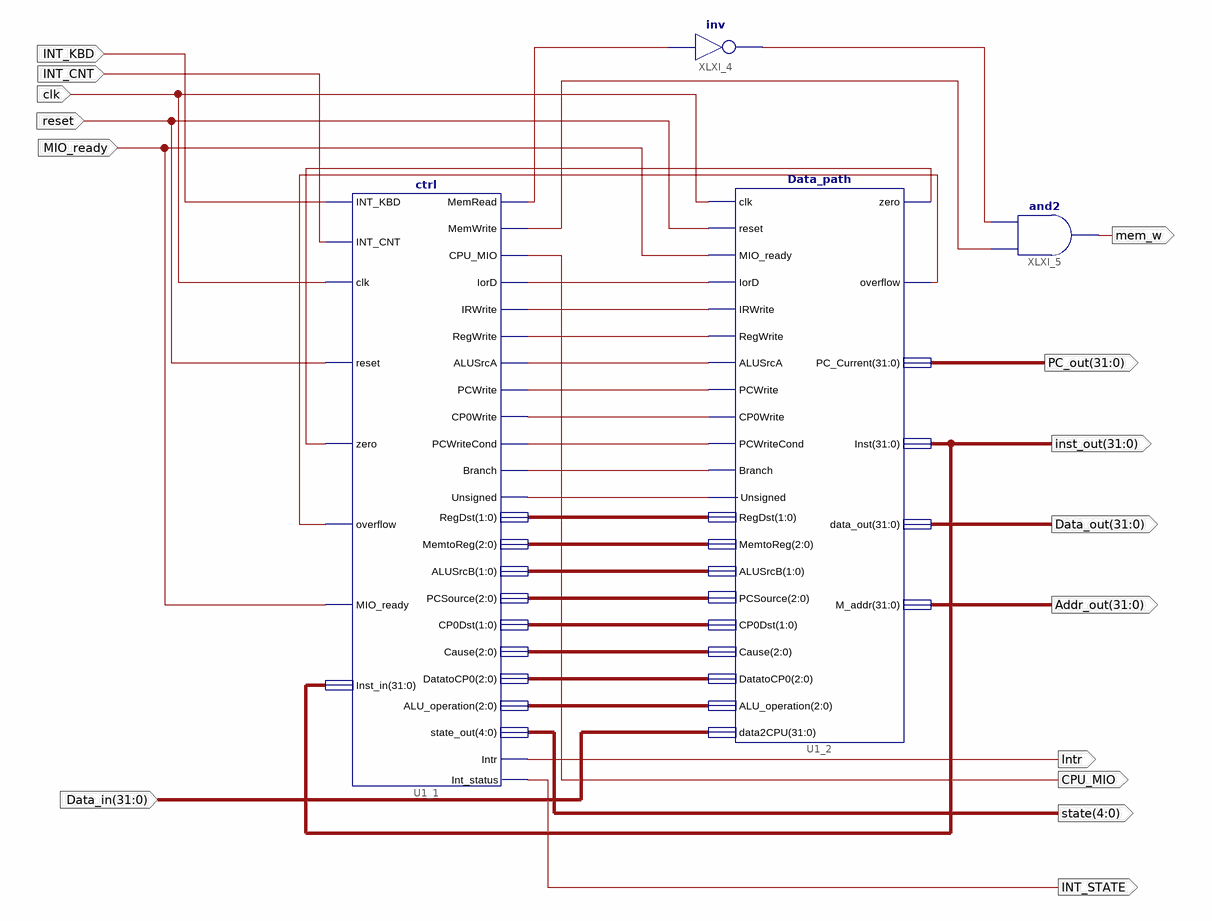
[diagram p0: schematic sheet 1]
// Xilinx ISE schematic Muliti_CPU.sch (spartan3e) as structural Verilog: 4 symbols, 15 ports
module Muliti_CPU (
  input  INT_KBD,
  input  clk,
  input  reset,
  input  MIO_ready,
  input  [31:0] Data_in,
  input  INT_CNT,
  output mem_w,
  output [31:0] PC_out,
  output [31:0] Data_out,
  output [31:0] Addr_out,
  output CPU_MIO,
  output [31:0] inst_out,
  output Intr,
  output [4:0] state,
  output INT_STATE
);

  wire ALUSrcA, Branch, CP0Write, IorD, IRWrite, MemRead, MemWrite, neg_MemRead, overflow, PCWrite,
       PCWriteCond, RegWrite, Unsigned, zero;
  wire [1:0] ALUSrcB, CP0Dst, RegDst;
  wire [2:0] ALU_operation, Cause, DatatoCP0, MemtoReg, PC_Source;

  not XLXI_4 (neg_MemRead, MemRead);
  and XLXI_5 (mem_w, MemWrite, neg_MemRead);
  ctrl U1_1 (
    .MemRead(MemRead), .MemWrite(MemWrite), .CPU_MIO(CPU_MIO), .IorD(IorD), .IRWrite(IRWrite),
    .RegWrite(RegWrite), .ALUSrcA(ALUSrcA), .PCWrite(PCWrite), .CP0Write(CP0Write),
    .PCWriteCond(PCWriteCond), .Branch(Branch), .Unsigned(Unsigned), .RegDst(RegDst), .MemtoReg(MemtoReg),
    .ALUSrcB(ALUSrcB), .clk(clk), .reset(reset), .zero(zero), .overflow(overflow), .MIO_ready(MIO_ready),
    .Inst_in(inst_out), .INT_KBD(INT_KBD), .PCSource(PC_Source), .CP0Dst(CP0Dst), .Cause(Cause),
    .DatatoCP0(DatatoCP0), .ALU_operation(ALU_operation), .state_out(state), .INT_CNT(INT_CNT), .Intr(Intr),
    .Int_status(INT_STATE));
  Data_path #(.VeriModel("Data_path")) U1_2 (
    .clk(clk), .reset(reset), .MIO_ready(MIO_ready), .IorD(IorD), .IRWrite(IRWrite), .RegWrite(RegWrite),
    .ALUSrcA(ALUSrcA), .PCWrite(PCWrite), .zero(zero), .overflow(overflow), .PC_Current(PC_out),
    .Inst(inst_out), .data_out(Data_out), .M_addr(Addr_out), .CP0Write(CP0Write), .PCWriteCond(PCWriteCond),
    .Branch(Branch), .RegDst(RegDst), .MemtoReg(MemtoReg), .ALUSrcB(ALUSrcB), .Unsigned(Unsigned),
    .PCSource(PC_Source), .CP0Dst(CP0Dst), .Cause(Cause), .DatatoCP0(DatatoCP0),
    .ALU_operation(ALU_operation), .data2CPU(Data_in));
endmodule
